# EAGLE design OsuKB (EAGLE 6.3)
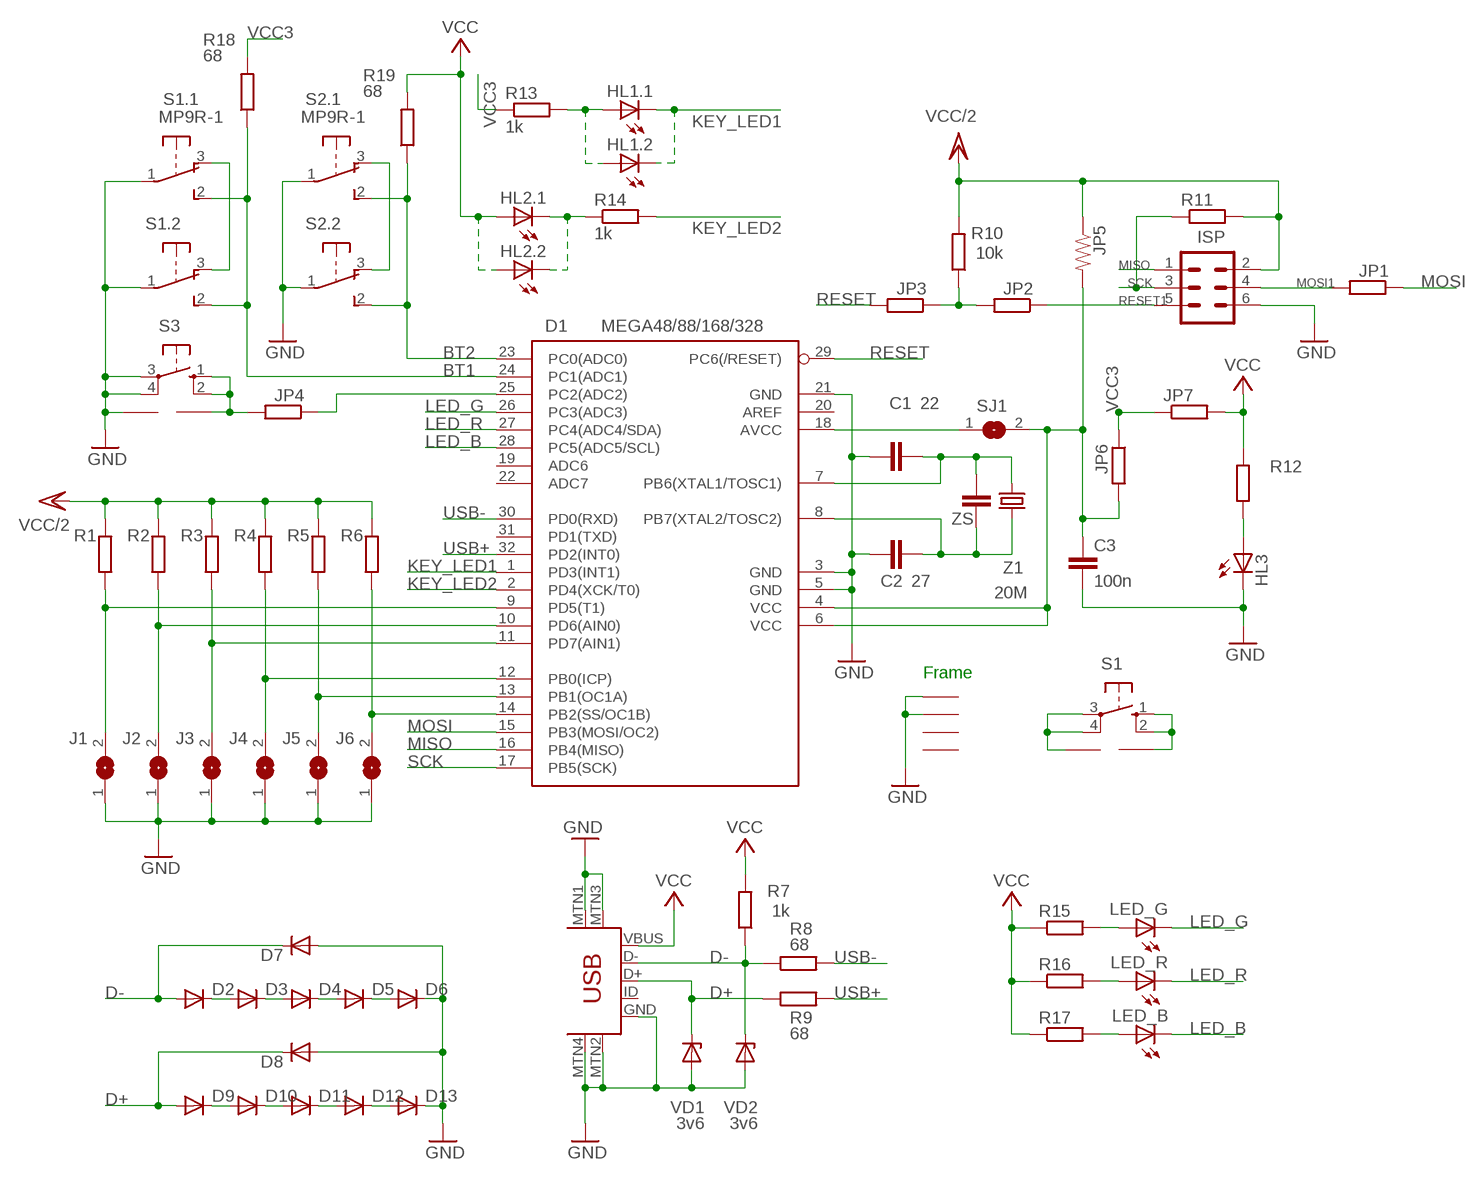
[diagram p0: schematic, sheet 1]

## Parts
C1  22  C-EUC0805  [C0805]
C2  27  C-EUC0805  [C0805]
C3  100n  C-EUC0805  [C0805]
D1  MEGA48/88/168/328  MEGA8-AI  [TQFP32-08]
D2  DIODE-SOD80C  [SOD80C]
D3  DIODE-SOD80C  [SOD80C]
D4  DIODE-SOD80C  [SOD80C]
D5  DIODE-SOD80C  [SOD80C]
D6  DIODE-SOD80C  [SOD80C]
D7  DIODE-SOD80C  [SOD80C]
D8  DIODE-SOD80C  [SOD80C]
D9  DIODE-SOD80C  [SOD80C]
D10  DIODE-SOD80C  [SOD80C]
D11  DIODE-SOD80C  [SOD80C]
D12  DIODE-SOD80C  [SOD80C]
D13  DIODE-SOD80C  [SOD80C]
GND  KB2  [KB2]
HL1.1  LEDSQR2X5  [LED2X5]
HL1.2  LEDSQR2X5  [LED2X5]
HL2.1  LEDSQR2X5  [LED2X5]
HL2.2  LEDSQR2X5  [LED2X5]
HL3  LEDSML0805  [SML0805]
ISP  MA03-2  [MA03-2]
J1  SJ  [SJ]
J2  SJ  [SJ]
J3  SJ  [SJ]
J4  SJ  [SJ]
J5  SJ  [SJ]
J6  SJ  [SJ]
JP1  R-EU_R1206W  [R1206W]
JP2  R-EU_R1206W  [R1206W]
JP3  R-EU_R1206W  [R1206W]
JP4  R-EU_R1206W  [R1206W]
JP5  RESISTOR0805-RES  [0805]
JP6  R-EU_R1206W  [R1206W]
JP7  R-EU_R1206W  [R1206W]
LED_B  LEDKA-3528ASYC  [KA-3528ASYC]
LED_G  LEDKA-3528ASYC  [KA-3528ASYC]
LED_R  LEDKA-3528ASYC  [KA-3528ASYC]
R1  R-EU_R1206W  [R1206W]
R2  R-EU_R1206W  [R1206W]
R3  R-EU_R1206W  [R1206W]
R4  R-EU_R1206W  [R1206W]
R5  R-EU_R1206W  [R1206W]
R6  R-EU_R0805  [R0805]
R7  1k  R-EU_R0805  [R0805]
R8  68  R-EU_R0805  [R0805]
R9  68  R-EU_R0805  [R0805]
R10  10k  R-EU_R1206W  [R1206W]
R11  R-EU_R0402  [R0402]
R12  R-EU_R0805  [R0805]
R13  1k  R-EU_R1206W  [R1206W]
R14  1k  R-EU_0207/12  [0207/12]
R15  R-EU_R0805  [R0805]
R16  R-EU_R0805  [R0805]
R17  R-EU_R0805  [R0805]
R18  68  R-EU_R0805  [R0805]
R19  68  R-EU_R0805  [R0805]
S1  10-XX  [B3F-10XX]
S1.1  MP9R-1  MP5  [MP5]
S1.2  MP5  [MP5]
S2.1  MP9R-1  MP5  [MP5]
S2.2  MP5  [MP5]
S3  10-XX  [B3F-10XX]
SJ1  SJ  [SJ]
U$1  PROGRAMMER_5.08  [PROGRAMMER_KEY]
U$6  PROGRAMMER_5.08  [PROGRAMMER_KEY]
VD1  3v6  ZENER-DIODEDO34-7  [DO34Z7]
VD2  3v6  ZENER-DIODEDO34-7  [DO34Z7]
X1  USB-MINIB-5PIN  [USB-MINIB]
Z1  20M  CRYSTALHC49S  [HC49/S]
ZS  C-EUC1812K  [C1812K]

## Nets
AVCC: D1.18(AVCC) SJ1.1
BT1: D1.24(PC1(ADC1)) R18.1 S1.1.2 S1.2.2
BT2: D1.23(PC0(ADC0)) R19.1 S2.1.2 S2.2.2
BT3: D1.25(PC2(ADC2)) JP4.1
D+: D8.C D9.A R9.1 VD1.C X1.D+
D-: D2.A D7.C R7.1 R8.1 VD2.C X1.D-
GND: C1.1 C2.1 C3.2 D1.3(GND) D1.5(GND) D1.21(GND) D6.C D7.A D8.A D13.C GND.P$1 GND.P$2 HL3.C ISP.6 J1.1 J2.1 J3.1 J4.1 J5.1 J6.1 S1.1.1 S1.2.1 S2.1.1 S2.2.1 S3.3(P) S3.4(P1) U$6.P$1 VD1.A VD2.A X1.GND X1.MTN1(MTN2) X1.MTN2(MTN3) X1.MTN3(MTN1) X1.MTN4
KEY_LED1: D1.1(PD3(INT1)) HL1.1.K(C) HL1.2.K(C)
KEY_LED2: D1.2(PD4(XCK/T0)) R14.2
KEY_LED2.1: HL2.1.K(C) HL2.2.K(C) R14.1
LED_B: D1.28(PC5(ADC5/SCL)) LED_B.C
LED_G: D1.26(PC3(ADC3)) LED_G.C
LED_R: D1.27(PC4(ADC4/SDA)) LED_R.C
MISO: D1.16(PB4(MISO)) ISP.1
MOSI: D1.15(PB3(MOSI/OC2)) JP1.1
MOSI1: ISP.4 JP1.2
N$2: LED_G.A R15.2
N$3: D2.C D3.A
N$4: D3.C D4.A
N$5: D1.13(PB1(OC1A)) J5.2 R5.1
N$6: D1.14(PB2(SS/OC1B)) J6.2 R6.1
N$7: D1.10(PD6(AIN0)) J2.2 R2.1
N$8: D1.9(PD5(T1)) J1.2 R1.1
N$9: S1.1.3 S1.2.3
N$10: D1.11(PD7(AIN1)) J3.2 R3.1
N$11: D1.12(PB0(ICP)) J4.2 R4.1
N$12: HL1.1.A HL1.2.A R13.2
N$13: C1.2 D1.7(PB6(XTAL1/TOSC1)) Z1.1 ZS.1
N$14: C2.2 D1.8(PB7(XTAL2/TOSC2)) Z1.2 ZS.2
N$15: D4.C D5.A
N$16: HL3.A R12.1
N$17: S2.1.3 S2.2.3
N$18: LED_R.A R16.2
N$19: LED_B.A R17.2
N$20: D5.C D6.A
N$21: D9.C D10.A
N$22: JP2.2 JP3.1 R10.1
N$23: D10.C D11.A
N$24: D11.C D12.A
N$25: D12.C D13.A
N$26: C3.1 D1.4(VCC) D1.6(VCC) JP5.2 JP6.2 SJ1.2
N$31: S1.3(P) S1.4(P1) U$1.P$1
N$33: S1.1(S) S1.2(S1) U$1.P$2
RESET: D1.29(PC6(/RESET)) JP3.2
RESET1: ISP.5 JP2.1
S3: JP4.2 S3.1(S) S3.2(S1) U$6.P$2
SCK: D1.17(PB5(SCK)) ISP.3 R11.1
USB+: D1.32(PD2(INT0)) R9.2
USB-: D1.30(PD0(RXD)) R8.2
VCC: HL2.1.A HL2.2.A JP7.2 R7.2 R12.2 R15.1 R16.1 R17.1 R19.2 X1.VBUS
VCC3: JP6.1 JP7.1 R13.1 R18.2
VCC/2: ISP.2 JP5.1 R1.2 R2.2 R3.2 R4.2 R5.2 R6.2 R10.2 R11.2
Unconnected: D1.19(ADC6) D1.20(AREF) D1.22(ADC7) D1.31(PD1(TXD)) GND.P$3 GND.P$4 X1.ID

## Notes on the sheet
- Frame

## Library data of the parts
C1-C3 ZS = rcl:C-EU: CAPACITOR, European symbol
D1 = atmel:MEGA8: MICROCONTROLLER 8 Kbytes FLASH, 1 kbytes SRAM, 512 bytes EEPROM, USART, 6-channel 10 bit ADC, 2-channel 8 bit ADC Pin compatible with Atmega48, ATMega88, ATMega168 Source: avr.lbr; MPN: ATMEGA8-16AU; OC_FARNELL: 9171371; OC_NEWARK: 73M8863
D2-D13 = diode:DIODE-: DIODE
GND = osukb:KB2
HL1.1 HL1.2 HL2.1 HL2.2 HL3 LED_B LED_G LED_R = led:LED: LED OSRAM: - CHIPLED LG R971, LG N971, LY N971, LG Q971, LY Q971, LO R971, LY R971 LH N974, LH R974 LS Q976, LO Q976, LY Q976 LO Q996 - Hyper CHIPLED LW Q18S LB Q993, LB Q99A, LB R99A - SideLED LS A670, LO A670, LY A670, LG A670, LP A670 LB A673, LV A673, LT A673, LW A673 LH A674 LY A675 LS A676, LA A676, LO A676, LY A676, LW A676 LS A679, LY A679, LG A679 - Hyper Micro SIDELED® LS Y876, LA Y876, LO Y876, LY Y876 LT Y87S - SmartLED LW L88C, LW L88S LB L89C, LB L89S, LG L890 LS L89K, LO L89K, LY L89K LS L896, LA L896, LO L896, LY L896 - TOPLED LS T670, LO T670, LY T670, LG T670, LP T670 LSG T670, LSP T670, LSY T670, LOP T670, LYG T670 LG T671, LOG T671, LSG T671 LB T673, LV T673, LT T673, LW T673 LH T674 LS T676, LA T676, LO T676, LY T676, LB T676, LH T676, LSB T676, LW T676 LB T67C, LV T67C, LT T67C, LS T67K, LO T67K, LY T67K, LW E67C LS E67B, LA E67B, LO E67B, LY E67B, LB E67C, LV E67C, LT E67C LW T67C LS T679, LY T679, LG T679 LS T770, LO T770, LY T770, LG T770, LP T770 LB T773, LV T773, LT T773, LW T773 LH T774 LS E675, LA E675, LY E675, LS T675 LS T776, LA T776, LO T776, LY T776, LB T776 LHGB T686 LT T68C, LB T68C - Hyper Mini TOPLED® LB M676 - Mini TOPLED Santana® LG M470 LS M47K, LO M47K, LY M47K Source: http://www.osram.convergy.de LUXEON: - LUMILED® LXK2-PW12-R00, LXK2-PW12-S00, LXK2-PW14-U00, LXK2-PW14-V00 LXK2-PM12-R00, LXK2-PM12-S00, LXK2-PM14-U00 LXK2-PE12-Q00, LXK2-PE12-R00, LXK2-PE12-S00, LXK2-PE14-T00, LXK2-PE14-U00 LXK2-PB12-K00, LXK2-PB12-L00, LXK2-PB12-M00, LXK2-PB14-N00, LXK2-PB14-P00, LXK2-PB14-Q00 LXK2-PR12-L00, LXK2-PR12-M00, LXK2-PR14-Q00, LXK2-PR14-R00 LXK2-PD12-Q00, LXK2-PD12-R00, LXK2-PD12-S00 LXK2-PH12-R00, LXK2-PH12-S00 LXK2-PL12-P00, LXK2-PL12-Q00, LXK2-PL12-R00 Source: www.luxeon.com KINGBRIGHT: KA-3528ASYC Source: www.kingbright.com
ISP = con-lstb:MA03-2: PIN HEADER
J1-J6 SJ1 = jumper:SJ: SMD solder JUMPER
JP1-JP4 JP6 R1-R12 R14-R19 = rcl:R-EU_: RESISTOR, European symbol
JP5 = SparkFun-Resistors:RESISTOR: Resistor Basic schematic elements and footprints for 0603, 1206, and PTH resistors.
JP7 R13 = osukb:R-EU_: RESISTOR, European symbol
S1 S3 = osukb:10-XX: OMRON SWITCH; MPN: B3F-1000; OC_FARNELL: 176432; OC_NEWARK: 36M3542
S1.1 S1.2 S2.1 S2.2 = osukb:MP5
U$1 U$6 = osukb:PROGRAMMER_5.08
VD1 VD2 = diode:ZENER-DIODE: Z-Diode
X1 = SparkFun-Connectors:USB-MINIB: Mini-USB "B" connector with 5th pin broken out. Created new symbol breaking out 5th "ID" pin in mini/micro USB connector spec. See: http://en.wikipedia.org/wiki/Mini_usb#Cables. Uses same footprint as 4-pin symbol. Also added pins to connect to mounting / shield pads if required (probably not generally needed as signals aren't shielded once they leave the connector).
Z1 = crystal:CRYSTAL: CRYSTAL; OC_FARNELL: 1667008; OC_NEWARK: unknown

## Board
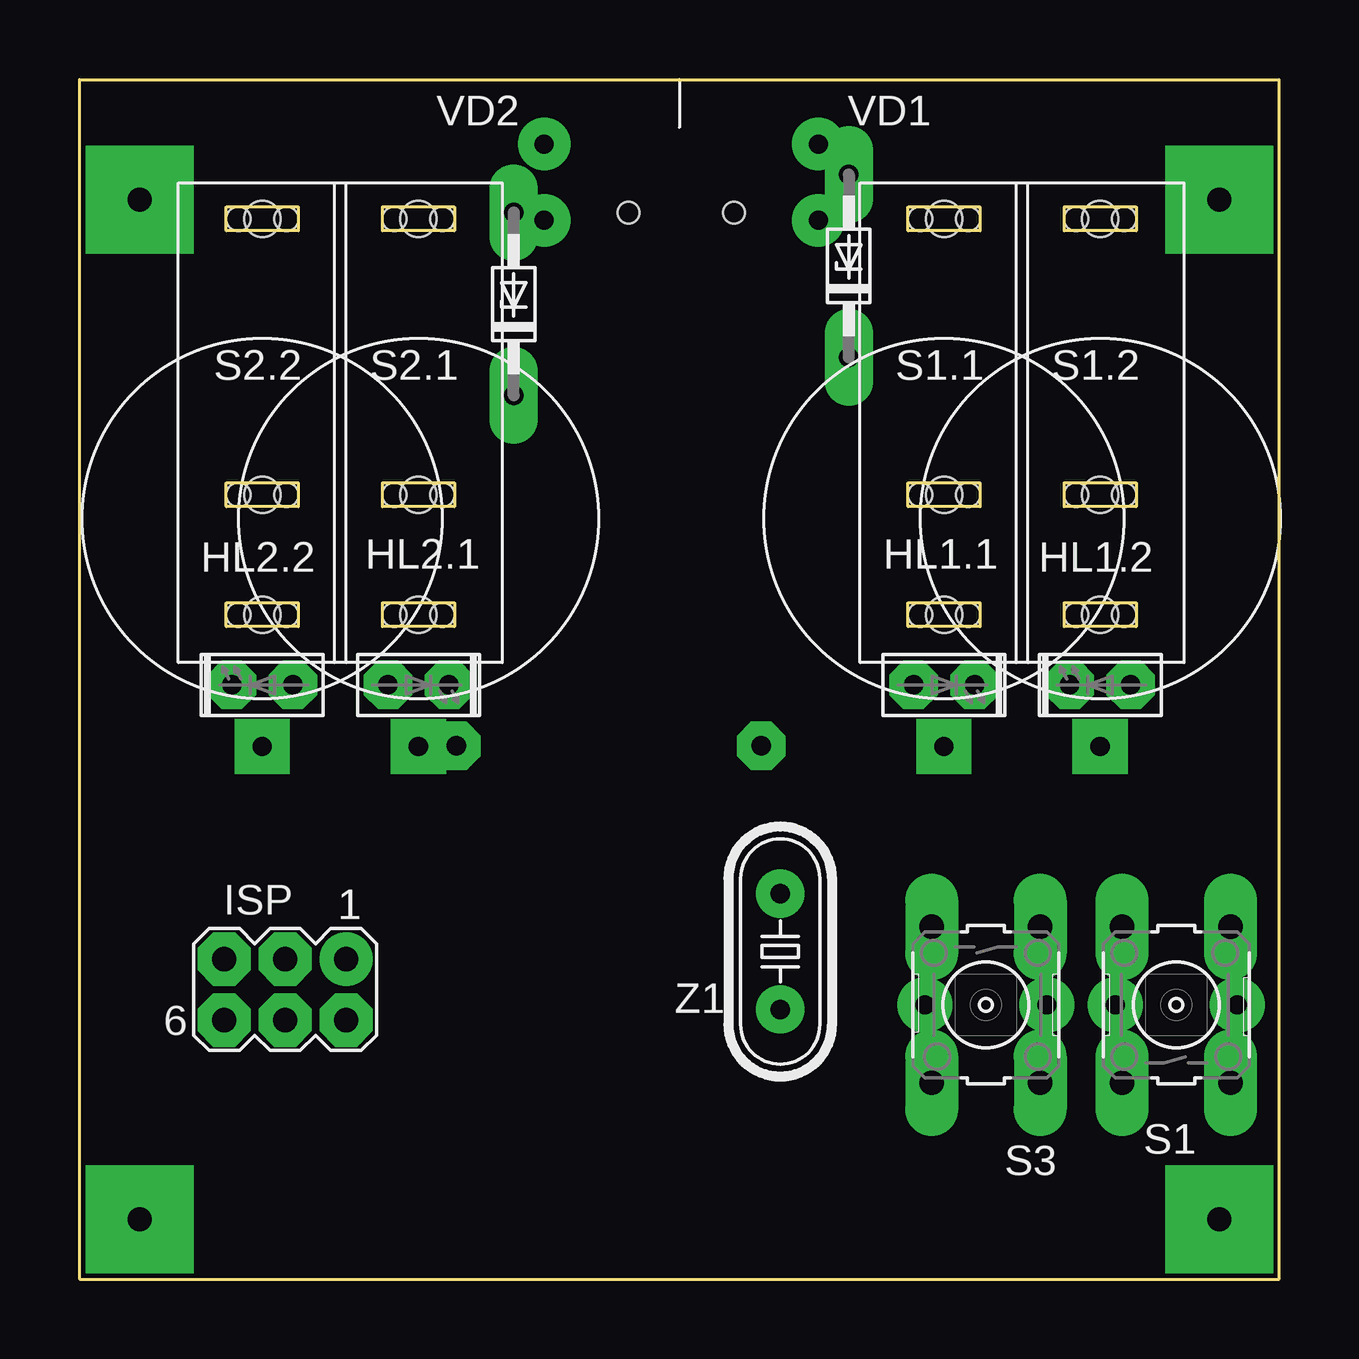
[diagram p1: board, top side]
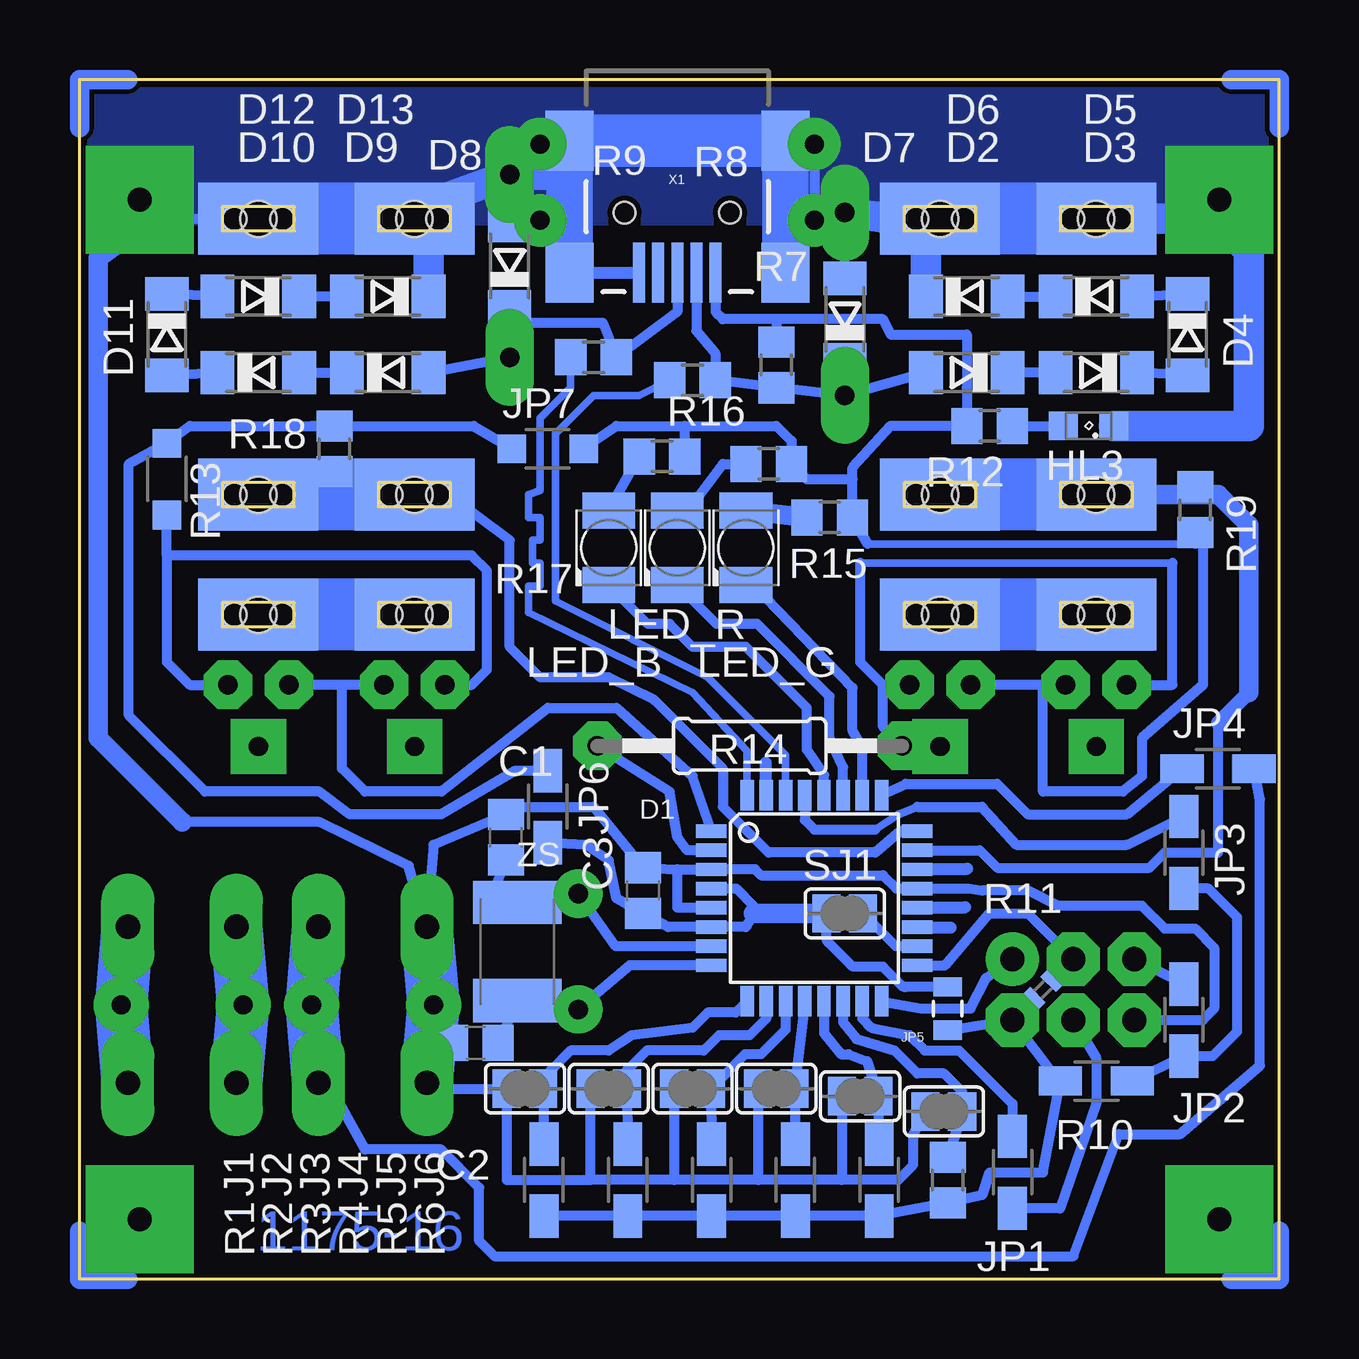
[diagram p2: board, bottom side, seen from below]

Size 50 x 50 mm. Coordinates in mm from the lower left corner, seen from the top.
Copper layers (1*16): Top 0.035mm / dielectric 1.5mm / Bottom 0.035mm
Design rules "DesignRules": minimum track width 8mil, minimum drill 24mil, track to track 0.2mm, track to pad 0.2mm, pad to pad 8mil, via to via 8mil, smd to smd 8mil, copper to edge 10mil, drill to drill 8mil, minimum pad ring 0.6mm, minimum via ring 8mil, stop-mask expansion 4mil, vias tented up to drill 0mil, thermal gap 10mil

### Footprints (pad centres in the part's own frame; a part is rotated, then mirrored left to right if it is on the bottom)
C0805 = smd 1.3 x 1.5: 1 -0.95,0; 2 0.95,0
TQFP32-08 = smd 1.27 x 0.559: 1 -4.293,2.8; 2 -4.293,2; 3 -4.293,1.2; 4 -4.293,0.4; 5 -4.293,-0.4; 6 -4.293,-1.2; 7 -4.293,-2; 8 -4.293,-2.8; 17 4.293,-2.8; 18 4.293,-2; 19 4.293,-1.2; 20 4.293,-0.4; 21 4.293,0.4; 22 4.293,1.2; 23 4.293,2; 24 4.293,2.8 | smd 0.559 x 1.27: 9 -2.8,-4.293; 10 -2,-4.293; 11 -1.2,-4.293; 12 -0.4,-4.293; 13 0.4,-4.293; 14 1.2,-4.293; 15 2,-4.293; 16 2.8,-4.293; 25 2.8,4.293; 26 2,4.293; 27 1.2,4.293; 28 0.4,4.293; 29 -0.4,4.293; 30 -1.2,4.293; 31 -2,4.293; 32 -2.8,4.293
SOD80C = smd 1.4 x 1.8: A 1.7,0; C -1.7,0
KB2 = drill 1 pad 4.5 square: P$1 2.5,45; P$2 47.5,45; P$3 2.5,2.5; P$4 47.5,2.5
LED2X5 = drill 0.813 octagon: A -1.27,0; K 1.27,0
SML0805 = smd 1.2 x 1.2: A 1.05,0; C -1.05,0
MA03-2 = drill 1.016: 1 -2.54,-1.27 | drill 1.016 octagon: 2 -2.54,1.27; 3 0,-1.27; 4 0,1.27; 5 2.54,-1.27; 6 2.54,1.27
SJ = smd 1.168 x 1.6: 1 -0.762,0; 2 0.762,0
R1206W = smd 1.8 x 1.2: 1 -1.499,0; 2 1.499,0
0805 = smd 0.8 x 1.2: 1 -0.9,0; 2 0.9,0
R1206W' = smd 1.2 x 1.2: 1 -1.499,0; 2 1.499,0
KA-3528ASYC = smd 1.5 x 2.2: A -1.55,0; C 1.55,0
R0805 = smd 1.3 x 1.5: 1 -0.95,0; 2 0.95,0
R0402 = smd 0.7 x 0.9: 1 -0.65,0; 2 0.65,0
0207/12 = drill 0.813 octagon: 1 -6.35,0; 2 6.35,0
B3F-10XX = drill 1.016 long: 1 -3.251,2.261; 2 3.251,2.261; 3 -3.251,-2.261; 4 3.251,-2.261
MP5 = smd 5 x 3 bottom: 1 0,8; 2 0,-3.5; 3 0,-8.5 | drill 0.8 pad 2.3 square: P$1 0,-14 | hole 1: 1,-8.5; -1,-8.5; 1,-3.5; -1,-3.5; 1,8; -1,8 | hole 1.5: 0,-8.5; 0,-3.5; 0,8
PROGRAMMER_KEY = drill 0.8 pad 2.3: P$1 -2.54,0.635; P$2 2.54,0.635
DO34Z7 = drill 0.813 long: A 3.81,0; C -3.81,0
USB-MINIB = smd 2.5 x 0.5: D+ 2.5,0; D- 2.5,0.8; GND 2.5,-1.6; ID 2.5,-0.8; VBUS 2.5,1.6 | smd 2.5 x 2: MTN1 -3,4.5; MTN2 2.5,4.5; MTN3 -3,-4.5; MTN4 2.5,-4.5 | hole 0.9: 0,2.2; 0,-2.2
HC49/S = drill 0.813: 1 -2.413,0; 2 2.413,0
C1812K = smd 1.8 x 3.7: 1 -2.05,0; 2 2.05,0

### Placement (x,y rotation side)
C1  32.23,18.41 270 bottom
C2  33.5,9.84 0 bottom
C3  26.51,16.19 90 bottom
D1  19.37,15.88 0 bottom
D2  13.02,37.78 180 bottom
D3  7.62,37.78 180 bottom
D4  3.81,39.37 270 bottom
D5  7.62,40.96 0 bottom
D6  13.02,40.96 0 bottom
D7  18.1,40.01 90 bottom
D8  32.07,42.23 90 bottom
D9  37.15,37.78 0 bottom
D10  42.55,37.78 0 bottom
D11  46.36,39.37 270 bottom
D12  42.55,40.96 180 bottom
D13  37.15,40.96 180 bottom
GND  0,0 0 top
HL1.1  36.04,24.77 0 top
HL1.2  42.55,24.77 180 top
HL2.1  14.13,24.77 0 top
HL2.2  7.62,24.77 180 top
HL3  7.94,35.56 180 bottom
ISP  8.57,12.06 180 top
J1  31.43,7.94 0 bottom
J2  27.94,7.94 0 bottom
J3  24.45,7.94 0 bottom
J4  20.95,7.94 0 bottom
J5  17.46,7.62 0 bottom
J6  13.97,6.98 0 bottom
JP1  11.11,4.45 270 bottom
JP2  3.97,10.79 270 bottom
JP3  3.97,17.78 90 bottom
JP4  2.54,21.27 0 bottom
JP5  13.81,11.27 90 bottom
JP6  30.48,19.69 270 bottom
JP7  [R1206W']  30.48,34.61 0 bottom
LED_B  27.94,30.48 270 bottom
LED_G  22.23,30.48 270 bottom
LED_R  25.08,30.48 270 bottom
R1  30.64,4.13 270 bottom
R2  27.15,4.13 270 bottom
R3  23.65,4.13 270 bottom
R4  20.16,4.13 270 bottom
R5  16.67,4.13 270 bottom
R6  13.81,4.13 270 bottom
R7  20.95,38.1 90 bottom
R8  24.45,37.46 180 bottom
R9  28.58,38.42 180 bottom
R10  7.62,8.25 180 bottom
R11  9.84,12.06 225 bottom
R12  12.06,35.56 180 bottom
R13  1k  [R1206W']  46.36,33.34 270 bottom
R14  22.07,22.23 180 bottom
R15  18.73,31.75 180 bottom
R16  21.27,33.97 180 bottom
R17  25.72,34.29 180 bottom
R18  39.37,34.61 90 bottom
R19  3.49,32.07 270 bottom
S1  45.72,11.43 90 top
S1.1  36.04,36.2 0 top
S1.2  42.55,36.2 0 top
S2.1  14.13,36.2 0 top
S2.2  7.62,36.2 0 top
S3  37.78,11.43 270 top
SJ1  18.1,15.24 180 bottom
U$1  45.72,12.06 180 top
U$6  37.78,10.79 0 top
VD1  32.07,42.23 90 top
VD2  18.1,40.64 90 top
X1  25.08,44.45 270 bottom
Z1  29.21,13.65 270 top
ZS  31.75,13.65 270 bottom

### Tracks (layer width: path | path; a pad name or v marks a point on that pad's centre or on a via)
AVCC
  Bottom 0.406: D1.18 15.97,13.88 SJ1.1
BT1
  Bottom 0.406: D1.24 15.77,18.67 16.83,17.78 21.27,17.78 23.18,19.69 23.18,21.27 26.04,24.13 27.94,25.08 30.8,25.08 32.07,26.35 32.07,30.8 34.61,32.7 37.14,32.7 S1.1.2 | R18.1 40.32,32.7
  Bottom 2.997: S1.1.2 40.32,32.7 S1.2.2
BT2
  Bottom 0.406: 2.54,23.18 2.54,17.78 4.76,17.78 5.4,17.15 11.75,17.15 12.48,17.88 D1.23 | R19.1 3.81,32.7
  Bottom 0.61: 1.27,24.45 2.54,23.18
  Bottom 0.813: 1.27,24.45 1.27,31.43 2.54,32.7 3.81,32.7 S2.2.2
  Bottom 2.997: S2.2.2 S2.1.2
BT3
  Bottom 0.406: D1.25 15.56,20.64 11.75,20.64 10.48,19.37 6.35,19.37 JP4.1
D+
  Bottom 0.406: D9.A VD1.C 32.07,39.85 | 32.07,39.85 D8.C | X1.D+ 25.08,40.32 R9.1 28.18,39.85 32.07,39.85
D-
  Bottom 0.406: D2.A VD2.C | D7.C VD2.C | VD2.C R7.1 R8.1 23.5,38.58 24.28,39.52 X1.D-
GND  (via drill 0.8 pad 2.18)
  Bottom 0.406: 28.7,4.13 32.19,4.13 J1.1 35.56,7.94 S3.4 C2.1 | 28.7,4.13 J2.1 | 18.22,4.13 15.87,4.13 15.24,4.76 15.24,6.03 J6.1 | 18.22,4.13 21.72,4.13 | 21.72,4.13 25.21,4.13 | 25.21,4.13 28.7,4.13 | J3.1 25.21,4.13 | J4.1 21.72,4.13 | J5.1 18.22,4.13 | S2.1.1 14.94,44.05 14.72,43.83 | S1.1.1 36.51,44.43 35.66,44.73 35.45,44.52 | D7.A VD2.A 18.1,45.4 v19.37,44.13 v19.37,47.31 | VD1.A D8.A | v19.37,47.31 21.27,47.31 21.27,47.94 19.37,47.94 v19.37,47.31 | 45.72,19.05 40.01,19.05 36.27,17.22 S3.3 35.24,18.1 C1.1 32.7,19.69 28.58,19.69 C3.2 25.08,17.08 | 46.93,44.2 S1.2.1 | D1.5 25.08,15.48 25.08,17.08 | 25.08,17.08 D1.3 21.84,17.08 21.59,16.83 16.51,16.83 15.96,16.27 D1.21 12.94,16.27 12.38,16.19 10.48,16.19 9.21,15.56 5.71,15.56 4.76,14.6 3.49,14.6 2.7,13.81 2.7,11.27 3.17,10.79 ISP.6
  Bottom 0.508: X1.MTN4 X1.GND
  Bottom 0.813: 45.72,19.05 49.21,22.54 49.21,42.55 46.93,44.2
  Bottom 1.27: S2.2.1 2.6,44.2 1.27,42.86 1.27,35.56 HL3.C | D6.C 14.72,43.83 | 14.94,44.05 VD2.A 20.58,43.82 | 29.58,46.04 VD1.A 36.51,44.43 | D13.C 35.45,44.52
  Bottom 1.93: X1.MTN1 20.58,43.82 X1.MTN2 | X1.MTN3 29.58,46.04 X1.MTN4
  Bottom 2.184: X1.MTN3 X1.MTN1 | S3.4 U$6.P$1 S3.3
  Bottom 2.997: S2.2.1 S2.1.1 | S1.1.1 S1.2.1
  other vias: 30.8,47.31 30.8,44.13
  pour Bottom (no thermals): 0.63,49.85 49.85,49.85 49.85,44.13 0.63,44.13
KEY_LED1
  Bottom 0.406: HL1.1.K 39.05,24.77 | 39.05,24.77 HL1.2.K | 39.05,24.77 39.05,21.27 38.1,20.32 34.93,20.32 30.48,23.81 27.62,23.81 24.45,20.95 D1.1
KEY_LED2
  Bottom 0.406: D1.2 24.67,17.88 25.08,18.41 25.4,20.32 R14.2
KEY_LED2.1
  Bottom 0.305: 4.44,29.84 17.46,29.84
  Bottom 0.406: HL2.2.K 4.44,24.77 4.44,29.84 | 17.46,29.84 17.46,25.72 16.51,24.77 | HL2.1.K 16.51,24.77 | R14.1 16.51,23.02 16.51,24.77
LED_B
  Bottom 0.406: D1.28 18.97,21.03 19.69,22.07 19.69,23.81 22.23,26.35 24.45,26.35 25.4,27.3 26.31,27.3 LED_B.C
LED_G
  Bottom 0.305: 21.31,28.93 21.91,28.93 LED_G.C
  Bottom 0.406: 22.23,28.89 LED_G.C | D1.26 17.37,22.13 17.78,22.86 17.78,24.64 21.91,28.93
LED_R
  Bottom 0.406: LED_R.C 23.46,27.3 21.75,27.3 18.73,24.29 18.73,22.54 18.17,21.34 D1.27
MISO
  Bottom 0.406: D1.16 14.92,11.27 12.86,11.27 12.22,12.54 ISP.1
MOSI
  Bottom 0.406: D1.15 17.37,10.86 16.99,10.48 15.4,10.16 14.76,9.52 13.33,9.52 11.11,7.3 JP1.1
MOSI1
  Bottom 0.406: ISP.4 7.62,9.21 7.62,7.3 9.12,2.95 JP1.2
N$1
  Bottom 0.406: 17.46,15.24 18.73,15.24
N$2
  Bottom 0.813: R15.2 LED_G.A
N$3
  Bottom 0.406: D3.A D2.C
N$4
  Bottom 0.406: 5.6,37.67 D3.C D4.A
N$5
  Bottom 0.406: R5.1 J5.2 17.18,9.08 17.94,9.37 18.26,9.37 18.97,10.24 D1.13
N$6
  Bottom 0.406: R6.1 J6.2 13.21,7.81 13.97,8.57 15.08,8.57 16.03,9.52 17.62,10 18.17,10.71 D1.14
N$7
  Bottom 0.406: R2.1 J2.2 27.18,8.7 26.35,9.52 23.97,9.52 23.34,10.16 22.07,10.16 21.37,10.86 D1.10
N$8
  Bottom 0.406: R1.1 J1.2 30.35,8.7 29.53,9.52 27.94,9.52 26.99,10.16 24.45,10.48 23.81,11.11 22.64,11.11 D1.9
N$9
  Bottom 2.997: S1.1.3 S1.2.3
N$10
  Bottom 0.406: R3.1 J3.2 22.26,9.37 21.59,9.37 20.57,10.39 D1.11
N$11
  Bottom 0.406: R4.1 J4.2 D1.12
N$12
  Bottom 0.406: HL1.1.A 33.66,24.77 33.02,25.4 33.02,29.53 33.66,30.16 46.36,30.16 | 46.36,30.16 46.36,25.72 45.4,24.77 HL1.2.A | 46.36,30.16 R13.2
N$13
  Bottom 0.406: D1.7 27.65,13.88 Z1.1 ZS.1 32.7,15.7 32.7,15.88 32.86,15.88 C1.2
N$14
  Bottom 0.406: C2.2 ZS.2 Z1.2 27.06,13.08 D1.8
N$15
  Bottom 0.406: D5.A D4.C
N$16
  Bottom 0.406: R12.1 HL3.A
N$17
  Bottom 2.997: S2.2.3 S2.1.3
N$18
  Bottom 0.406: LED_R.A 24.13,32.7 23.18,33.97 R16.2
N$19
  Bottom 0.406: LED_B.A R17.2
N$20
  Bottom 0.406: D6.A D5.C
N$21
  Bottom 0.406: D10.A D9.C
N$22
  Bottom 0.406: R10.1 JP2.2 2.77,9.3 1.75,10.32 1.75,15.08 2.95,16.28 JP3.1
N$23
  Bottom 0.406: D11.A D10.C
N$24
  Bottom 0.406: D12.A D11.C
N$25
  Bottom 0.406: D13.A D12.C
N$26
  Bottom 0.406: JP5.2 15.56,12.17 arc45 15.74,12.25 16.51,13.02 17.67,13.02 arc45 17.85,13.09 18.79,14.02 arc45 18.86,14.2 SJ1.2 | JP6.2 28.89,18.1 27.94,17.46 27.62,15.88 C3.1 25.47,14.67 D1.6 22.23,14.67 21.91,15.24 21.91,15.56 22.62,16.27 D1.4
  Bottom 0.813: SJ1.2 21.91,15.24
N$27
  Bottom 0.508: 14.83,17.09 13.01,17.09
N$28
  Bottom 0.508: 14.83,15.49 13.08,15.49
N$29
  Bottom 0.508: 14.83,14.66 13.69,14.66
N$30
  Bottom 0.508: 21.39,20.3 21.39,21.51
N$31
  Bottom 2.184: S1.4 U$1.P$1 S1.3
N$33
  Bottom 2.184: S1.1 U$1.P$2 S1.2
RESET
  Bottom 0.305: 16.83,18.73 15.87,19.37
  Bottom 0.356: 15.87,19.37 15.08,19.69
  Bottom 0.406: D1.29 19.77,19.13 19.37,18.73 16.83,18.73 | JP3.2 6.35,18.1 10.95,18.1 12.38,19.69 15.08,19.69
RESET1
  Bottom 0.406: JP2.1 ISP.5
S3
  Bottom 0.406: JP4.2 0.79,20 0.79,8.89 4.13,6.03 6.67,6.03 8.57,0.95 32.7,0.95 33.34,1.59 33.34,3.81 34.93,5.4 38.1,5.4 39.69,8.25 S3.2
  Bottom 2.184: S3.1 U$6.P$2 S3.2
SCK
  Bottom 0.406: R11.1 ISP.3 10.48,15.24 12.06,15.24 13.91,13.08 D1.17
USB+
  Bottom 0.305: R9.2 29.52,37.15 30.8,35.88 30.8,32.86 31.27,32.7 31.27,31.75 30.8,31.75 30.8,30.8 31.12,30.8 31.12,29.84 30.8,29.84 30.8,28.89 31.27,28.89 31.27,27.78 24.45,24.45 22.17,22.01 D1.32
USB-
  Bottom 0.305: R8.2 26.67,36.83 28.58,36.83 30.16,35.24 30.16,28.26 23.81,25.08 20.57,21.84 D1.30
VCC
  Bottom 0.305: 17.14,30.64 3.49,30.64 3.17,30.64
  Bottom 0.406: X1.VBUS 23.48,40.31 23.18,40.01 20.95,40.01 | 20.95,40.01 16.51,40.01 16.19,39.37 13.02,39.37 13.02,37.15 13.01,37.15 R12.2 16.19,35.56 17.78,33.81 17.78,33.34 | 20.95,40.01 R7.2 | R17.1 24.77,35.56 | 24.77,35.56 20.95,35.56 20.32,34.93 R16.1 19.69,33.34 17.78,33.34 | 24.77,35.56 27.62,35.56 JP7.2 | HL2.2.A 9.84,24.77 | 9.84,24.77 HL2.1.A | 9.84,24.77 9.84,20.32 6.51,20.32 5.71,20.95 5.71,22.54 3.17,24.77 3.17,30.64 | 17.14,30.64 R15.1 17.78,33.34 | R19.2 3.49,30.64
VCC3
  Bottom 0.406: JP6.1 31.84,21.18 34.93,19.37 38.73,19.37 40.01,20.32 44.77,20.32 47.94,23.49 47.94,33.97 R13.1 45.4,35.56 40.32,35.56 | 40.32,35.56 33.57,35.56 JP7.1 | R18.2 40.32,35.56
VCC/2
  Bottom 0.406: ISP.2 R11.2 | R1.2 R2.2 R3.2 R4.2 R5.2 R6.2 12.38,3.49 12.06,4.45 9.84,4.45 R10.2 9.21,8.25 ISP.2 | JP5.1 ISP.2

### Text on the board
Bottom: 1175-16